# Altium schematic sheet Sheet1.SchDoc
size B
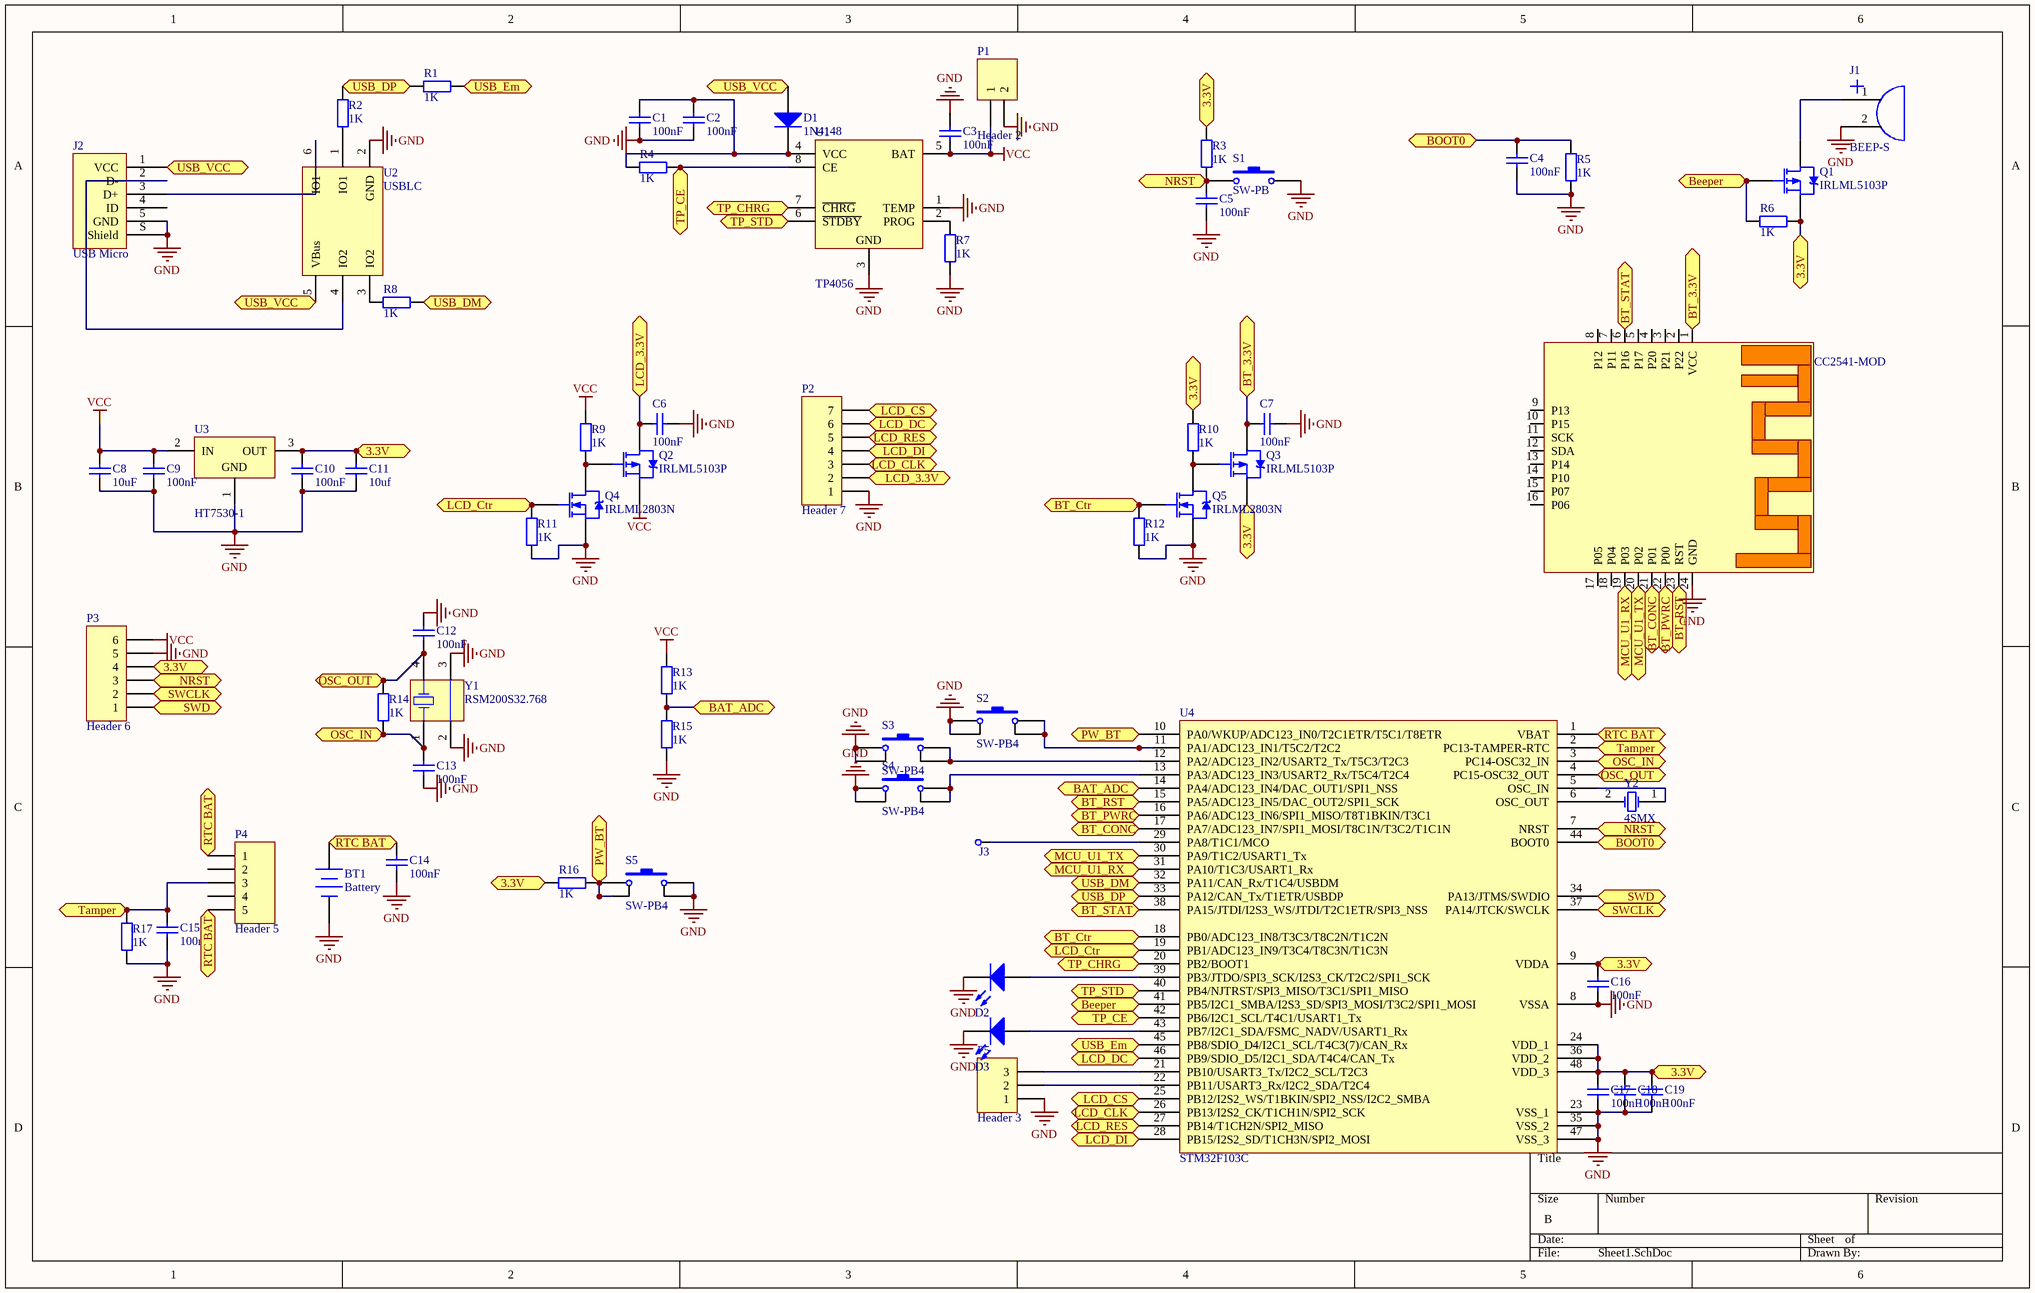
[diagram p0: Sheet1.SchDoc]

## Parts
?  CC2541-MOD  [JDY-08]
BT1  Battery  [CR1220]
C1  value 100nF  [C-0805]  (hidden comment: Cap-S)
C2  value 100nF  [C-0805]  (hidden comment: Cap-S)
C3  value 100nF  [C-0805]  (hidden comment: Cap-S)
C4  value 100nF  [C-0805]  (hidden comment: Cap-S)
C5  value 100nF  [C-0805]  (hidden comment: Cap-S)
C6  value 100nF  [C-0805]  (hidden comment: Cap-S)
C7  value 100nF  [C-0805]  (hidden comment: Cap-S)
C8  value 10uF  [C-0805]  (hidden comment: Cap-S)
C9  value 100nF  [C-0805]  (hidden comment: Cap-S)
C10  value 100nF  [C-0805]  (hidden comment: Cap-S)
C11  value 10uf  [C-0805]  (hidden comment: Cap-S)
C12  value 100nF  [C-0805]  (hidden comment: Cap-S)
C13  value 100nF  [C-0805]  (hidden comment: Cap-S)
C14  value 100nF  [C-0805]  (hidden comment: Cap-S)
C15  value 100nF  [C-0805]  (hidden comment: Cap-S)
C16  value 100nF  [C-0805]  (hidden comment: Cap-S)
C17  value 100nF  [C-0805]  (hidden comment: Cap-S)
C18  value 100nF  [C-0805]  (hidden comment: Cap-S)
C19  value 100nF  [C-0805]  (hidden comment: Cap-S)
D1  1N4148  [D-SMA]
D2  LED0  [LED-0805]  (value not drawn)
D3  LED0  [LED-0805]  (value not drawn)
J1  BEEP-S  [BEEP-S]
J2  USB Micro  [FCI USB 10118193-0001LF]
J3  CHECK  [CHECK-A]  (value not drawn)
P1  Header 2  [HDR1X2]
P2  Header 7  [HDR1X7]
P3  Header 6  [HDR1X6]
P4  Header 5  [HDR1X5]
P5  Header 3  [HDR1X3]
Q1  IRLML5103P  [SOT-23_N]
Q2  IRLML5103P  [SOT-23_N]
Q3  IRLML5103P  [SOT-23_N]
Q4  IRLML2803N  [SOT-23_N]
Q5  IRLML2803N  [SOT-23_N]
R1  value 1K  [0805-1]  (hidden comment: Res1)
R2  value 1K  [0603-1]  (hidden comment: Res1)
R3  value 1K  [0805-1]  (hidden comment: Res1)
R4  value 1K  [0603-1]  (hidden comment: Res1)
R5  value 1K  [0805-1]  (hidden comment: Res1)
R6  value 1K  [0805-1]  (hidden comment: Res1)
R7  value 1K  [0603-1]  (hidden comment: Res1)
R8  value 1K  [0603-1]  (hidden comment: Res1)
R9  value 1K  [0805-1]  (hidden comment: Res1)
R10  value 1K  [0805-1]  (hidden comment: Res1)
R11  value 1K  [0805-1]  (hidden comment: Res1)
R12  value 1K  [0805-1]  (hidden comment: Res1)
R13  value 1K  [0805-1]  (hidden comment: Res1)
R14  value 1K  [0603-1]  (hidden comment: Res1)
R15  value 1K  [0805-1]  (hidden comment: Res1)
R16  value 1K  [0805-1]  (hidden comment: Res1)
R17  value 1K  [0805-1]  (hidden comment: Res1)
S1  SW-PB  [SW_PB2_A1]
S2  SW-PB4  [SW_PB4_A1]
S3  SW-PB4  [SW_PB4_A1]
S4  SW-PB4  [SW_PB4_A1]
S5  SW-PB4  [SW_PB4_A1]
U1  TP4056  [SOIC-8P]
U2  USBLC  [SOT23-6]
U3  HT7530-1  [SOT89N]
U4  STM32F103C  [LQFP-48]
Y1  RSM200S32.768  [RSM200S]
Y2  4SMX  [4SMX]

## Ports
3.3V, BAT_ADC, Beeper, BOOT0, BT_3.3V, BT_CONC, BT_Ctr, BT_PWRC, BT_RST, BT_STAT, LCD_3.3V, LCD_CLK, LCD_CS, LCD_Ctr, LCD_DC, LCD_DI, LCD_RES, MCU_U1_RX, MCU_U1_TX, NRST, OSC_IN, OSC_OUT, PW_BT, RTC BAT, SWCLK, SWD, Tamper, TP_CE, TP_CHRG, TP_STD, USB_DM, USB_DP, USB_Em, USB_VCC

## Nets
GND: ?.24(GND) BT1.2(-) C1.1 C2.1 C3.2 C4.2 C5.2 C6.1 C7.1 C8.1 C9.1 C10.1 C11.1 C12.2 C13.1 C14.1 C15.2 C16.2 C17.2 C18.2 C19.2 D2.2(K) D3.2(K) J1.2 J2.5(GND) J2.S(Shield) P1.2 P2.1 P3.5 P5.1 Q4.2(S) Q5.2(S) R5.1 R7.2 R11.1 R12.1 R15.1 R17.1 S1.2 S2.1 S2.4 S3.1 S3.4 S4.1 S4.4 S5.2 S5.3 U1.1(TEMP) U1.3(GND) U2.2(GND) U3.1(GND) U4.8(VSSA) U4.23(VSS_1) U4.35(VSS_2) U4.47(VSS_3) Y1.2(COM) Y1.3(COM)
VCC: C3.1 C8.2 C9.2 P1.1 P3.6 Q2.2(S) R9.2 R13.2 U1.5(BAT) U3.2(IN)
3.3V: C10.2 C11.2 C16.1 C17.1 C18.1 C19.1 P3.4 Q1.2(S) Q3.2(S) R3.2 R6.1 R10.2 R16.1 U3.3(OUT) U4.9(VDDA) U4.24(VDD_1) U4.36(VDD_2) U4.48(VDD_3) ; port 3.3V
BAT_ADC: R13.1 R15.2 U4.14(PA4/ADC123_IN4/DAC_OUT1/SPI1_NSS) ; port BAT_ADC
Beeper: Q1.1(G) R6.2 U4.41(PB5/I2C1_SMBA/I2S3_SD/SPI3_MOSI/T3C2/SPI1_MOSI) ; port Beeper
BOOT0: C4.1 R5.2 U4.44(BOOT0) ; port BOOT0
BT_3.3V: ?.1(VCC) C7.2 Q3.3(D) ; port BT_3.3V
BT_CONC: ?.21(P01) U4.17(PA7/ADC123_IN7/SPI1_MOSI/T8C1N/T3C2/T1C1N) ; port BT_CONC
BT_Ctr: Q5.1(G) R12.2 U4.18(PB0/ADC123_IN8/T3C3/T8C2N/T1C2N) ; port BT_Ctr
BT_PWRC: ?.22(P00) U4.16(PA6/ADC123_IN6/SPI1_MISO/T8T1BKIN/T3C1) ; port BT_PWRC
BT_RST: ?.23(RST) U4.15(PA5/ADC123_IN5/DAC_OUT2/SPI1_SCK) ; port BT_RST
BT_STAT: ?.6(P16) U4.38(PA15/JTDI/I2S3_WS/JTDI/T2C1ETR/SPI3_NSS) ; port BT_STAT
LCD_3.3V: C6.2 P2.2 Q2.3(D) ; port LCD_3.3V
LCD_CLK: P2.3 U4.26(PB13/I2S2_CK/T1CH1N/SPI2_SCK) ; port LCD_CLK
LCD_CS: P2.7 U4.25(PB12/I2S2_WS/T1BKIN/SPI2_NSS/I2C2_SMBA) ; port LCD_CS
LCD_Ctr: Q4.1(G) R11.2 U4.19(PB1/ADC123_IN9/T3C4/T8C3N/T1C3N) ; port LCD_Ctr
LCD_DC: P2.6 U4.46(PB9/SDIO_D5/I2C1_SDA/T4C4/CAN_Tx) ; port LCD_DC
LCD_DI: P2.4 U4.28(PB15/I2S2_SD/T1CH3N/SPI2_MOSI) ; port LCD_DI
LCD_RES: P2.5 U4.27(PB14/T1CH2N/SPI2_MISO) ; port LCD_RES
MCU_U1_RX: ?.19(P03) U4.31(PA10/T1C3/USART1_Rx) ; port MCU_U1_RX
MCU_U1_TX: ?.20(P02) U4.30(PA9/T1C2/USART1_Tx) ; port MCU_U1_TX
NRST: C5.1 P3.3 R3.1 S1.1 U4.7(NRST) ; port NRST
OSC_IN: C13.2 R14.2 U4.3(PC14-OSC32_IN) Y1.1(OSC1) ; port OSC_IN
OSC_OUT: C12.1 R14.1 U4.4(PC15-OSC32_OUT) Y1.4(OSC2) ; port OSC_OUT
PW_BT: R16.2 S5.1 S5.4 U4.10(PA0/WKUP/ADC123_IN0/T2C1ETR/T5C1/T8ETR) ; port PW_BT
RTC BAT: BT1.1(+) C14.2 P4.1 P4.5 U4.1(VBAT) ; port RTC BAT
SWCLK: P3.2 U4.37(PA14/JTCK/SWCLK) ; port SWCLK
SWD: P3.1 U4.34(PA13/JTMS/SWDIO) ; port SWD
Tamper: C15.1 P4.3 R17.2 U4.2(PC13-TAMPER-RTC) ; port Tamper
TP_CE: R4.1 U1.8(CE) U4.42(PB6/I2C1_SCL/T4C1/USART1_Tx) ; port TP_CE
TP_CHRG: U1.7(~{CHRG}) U4.20(PB2/BOOT1) ; port TP_CHRG
TP_STD: U1.6(~{STDBY}) U4.40(PB4/NJTRST/SPI3_MISO/T3C1/SPI1_MISO) ; port TP_STD
USB_DM: R8.1 U4.32(PA11/CAN_Rx/T1C4/USBDM) ; port USB_DM
USB_DP: R1.1 R2.2 U4.33(PA12/CAN_Tx/T1ETR/USBDP) ; port USB_DP
USB_Em: R1.2 U4.45(PB8/SDIO_D4/I2C1_SCL/T4C3(7)/CAN_Rx) ; port USB_Em
USB_VCC: D1.1(A) J2.1(VCC) U2.5(VBus) ; port USB_VCC
NetC1_2: C1.2 C2.2 D1.2(K) R4.2 U1.4(VCC)
NetD2_1: D2.1(A) U4.39(PB3/JTDO/SPI3_SCK/I2S3_CK/T2C2/SPI1_SCK)
NetD3_1: D3.1(A) U4.43(PB7/I2C1_SDA/FSMC_NADV/USART1_Rx)
NetJ1_1: J1.1 Q1.3(D)
NetJ2_2: J2.2(D-) U2.4(IO2)
NetJ2_3: J2.3(D+) U2.6(IO1)
NetJ3_1: J3.1 U4.29(PA8/T1C1/MCO)
NetP5_2: P5.2 U4.22(PB11/USART3_Rx/I2C2_SDA/T2C4)
NetP5_3: P5.3 U4.21(PB10/USART3_Tx/I2C2_SCL/T2C3)
NetQ2_1: Q2.1(G) Q4.3(D) R9.1
NetQ3_1: Q3.1(G) Q5.3(D) R10.1
NetR2_1: R2.1 U2.1(IO1)
NetR7_1: R7.1 U1.2(PROG)
NetR8_2: R8.2 U2.3(IO2)
NetS2_2: S2.2 S2.3 U4.11(PA1/ADC123_IN1/T5C2/T2C2)
NetS3_2: S3.2 S3.3 U4.12(PA2/ADC123_IN2/USART2_Tx/T5C3/T2C3)
NetS4_2: S4.2 S4.3 U4.13(PA3/ADC123_IN3/USART2_Rx/T5C4/T2C4)
NetU4_5: U4.5(OSC_IN) Y2.1(OSC1)
NetU4_6: U4.6(OSC_OUT) Y2.2(OSC2)

Not connected (* = marked no-connect by the designer): ? 2(P22) 3(P21) 4(P20) 5(P17) 7(P11) 8(P12) 9(P13) 10(P15) 11(SCK) 12(SDA) 13(P14) 14(P10) 15(P07) 16(P06) 17(P05) 18(P04); J2 4(ID); P4 2 4

## Library data of the parts
BT1 = Battery: 备份电池; Published: 24-Mar-1999; LatestRevisionDate: 17-Jul-2002; LatestRevisionNote: Re-released for DXP Platform.; PackageReference: BAT-2; Publisher: Altium Limited
C1-C19 = Cap-S: 贴片瓷片电容; Published: 8-Jun-2000; LatestRevisionDate: 17-Jul-2002; LatestRevisionNote: Re-released for DXP Platform.; PackageReference: RAD-0.3; Publisher: Altium Limited
D1 = Diode: 二极管; Published: 8-Jun-2000; LatestRevisionDate: 17-Jul-2002; LatestRevisionNote: Re-released for DXP Platform.; PackageDocument: Sep-1996; PackageReference: SMC; Publisher: Altium Limited; Code_JEDEC: DO-214-AB
D2 D3 = LED0: 发光二极管; Published: 8-Jun-2000; LatestRevisionDate: 08-Jul-2005; LatestRevisionNote: Mech Layer 1 removed.; PackageReference: LED-0; Publisher: Altium Limited
J1 = BEEP-S: 有源蜂鸣器
J2 = USB 2.0 Type B Micro
J3 = CHECK: 测试点
P1 = Header 2: Header, 2-Pin; LatestRevisionDate: 17-Jul-2002; LatestRevisionNote: Re-released for DXP Platform.; Publisher: Altium Limited
P2 = Header 7: Header, 7-Pin; LatestRevisionDate: 17-Jul-2002; LatestRevisionNote: Re-released for DXP Platform.; Publisher: Altium Limited
P3 = Header 6: Header, 6-Pin; LatestRevisionDate: 17-Jul-2002; LatestRevisionNote: Re-released for DXP Platform.; Publisher: Altium Limited
P4 = Header 5: Header, 5-Pin; LatestRevisionDate: 17-Jul-2002; LatestRevisionNote: Re-released for DXP Platform.; Publisher: Altium Limited
P5 = Header 3: Header, 3-Pin; LatestRevisionDate: 17-Jul-2002; LatestRevisionNote: Re-released for DXP Platform.; Publisher: Altium Limited
Q1-Q3 = IRLML5103: HEXFET Power MOSFET; Published: 8-Jun-2000; LatestRevisionDate: 20-Nov-2009; LatestRevisionNote: IPC-7351 Footprint Added.; DatasheetVersion: Aug-1997; PackageReference: SOT-23; Publisher: Altium Limited; PackageDescription: 3-Pin SOT-23 Package 0.95 mm Pitch, 2.3 mm Lead Span; ComponentLink1Description: Manufacturer Link; ComponentLink1URL: http://www.irf.com/; ComponentLink2Description: Datasheet; ComponentLink2URL: http://www.irf.com/product-info/datasheets/data/irlml5103.pdf
Q4 Q5 = IRLML2803: HEXFET Power MOSFET; Published: 8-Jun-2000; LatestRevisionDate: 20-Nov-2009; LatestRevisionNote: IPC-7351 Footprint Added.; DatasheetVersion: Aug-1997; PackageReference: SOT-23; Publisher: Altium Limited; PackageDescription: 3-Pin SOT-23 Package 0.95 mm Pitch, 2.3 mm Lead Span; ComponentLink1Description: Manufacturer Link; ComponentLink1URL: http://www.irf.com/; ComponentLink2Description: Datasheet; ComponentLink2URL: http://www.irf.com/product-info/datasheets/data/irlml2803.pdf
R1-R17 = Res1: 贴片电阻; Published: 8-Jun-2000; LatestRevisionDate: 17-Jul-2002; LatestRevisionNote: Re-released for DXP Platform.; PackageReference: AXIAL-0.4; Publisher: Altium Limited
S1 = SW-PB: 微动开关; Published: 24-Mar-1999; LatestRevisionDate: 17-Jul-2002; LatestRevisionNote: Re-released for DXP Platform.; PackageReference: SPST-2; Publisher: Altium Limited
S2-S5 = SW-PB4: 微动开关; Published: 24-Mar-1999; LatestRevisionDate: 17-Jul-2002; LatestRevisionNote: Re-released for DXP Platform.; PackageReference: SPST-2; Publisher: Altium Limited
U1 = TP4056: 锂电池充电管理
U2 = TPS3808: DSP电源管理
U3 = HT7530-1: 3.0V 100mA Low Power,  Low Dropout Voltage (LDO) Regulator; Published: 30-Mar-2007; DatasheetVersion: rev1.50, Jan-2006; PackageVersion: Jan-2006; PackageReference: SOT-89; Publisher: Altium Limited; PackageDescription: 3-Pin SOT-89 Package 1.5 mm Pitch, 4.1 mm Lead Span; Code_IPC: SOT89; ComponentLink1Description: Manufacturer Link; ComponentLink1URL: http://www.holtek.com/; ComponentLink2Description: Datasheet; ComponentLink2URL: http://www.holtek.com/pdf/consumer/75xx_1v150.pdf
U4 = STM32F103C: STM32单片机48引脚
Y1 = RSM200S32.768: Surface Mount Tuning Fork Crystal Unit; Published: 8-Jun-2000; LatestRevisionDate: 17-Jul-2002; LatestRevisionNote: Re-released for DXP Platform.; DatasheetDocument: 28-Sep-1998; PackageReference: RSM200S; Publisher: Altium Limited; ComponentLink1Description: Manufacturer Link; ComponentLink1URL: http://www.raltron.com/products/microcrystals/default.asp; ComponentLink2Description: Datasheet; ComponentLink2URL: http://www.raltron.com/products/pdfspecs/crystal_rsm200s.pdf
Y2 = 4SMX: Surface Mount Quartz Crystal; Note: PCB layout complies with manufacturer's recommendation.; Published: 17-Jul-2002; DatasheetDocument: 9-Sep-1999; PackageDocument: 9-Sep-1999; PackageReference: 4SMX; Publisher: Altium Limited; ComponentLink1Description: Manufacturer Link; ComponentLink1URL: http://www.cmac.com/mt/